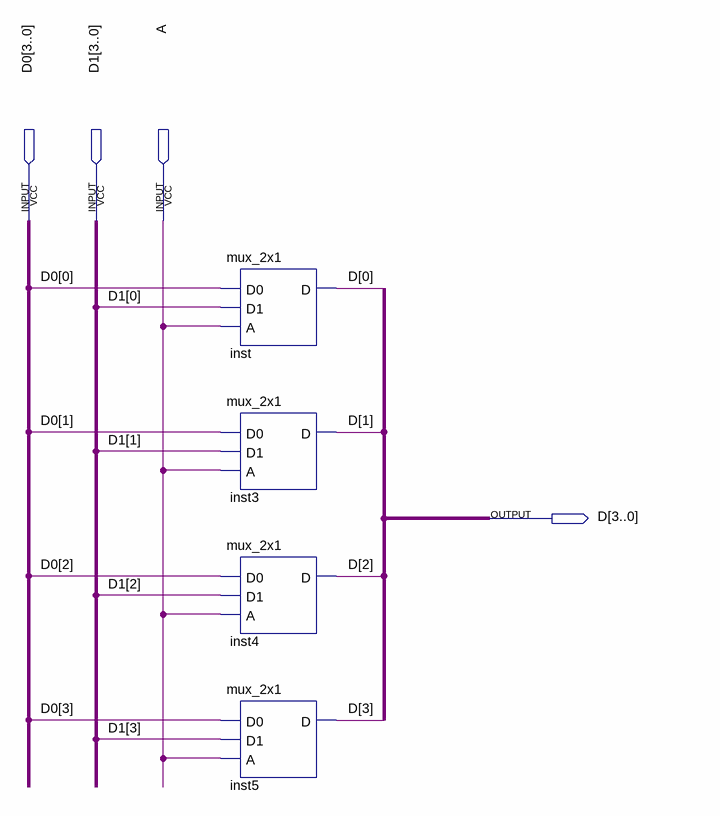
[diagram p0: schematic sheet]
// Quartus schematic mux_4b_2x1.bdf as structural Verilog: 4 symbols, 4 pins
module mux_4b_2x1 (
  input  [3:0] D0,
  input  [3:0] D1,
  input  A,
  output [3:0] D
);

  mux_2x1 inst (.D0(D0[0]), .D1(D1[0]), .A(A), .D(D[0]));
  mux_2x1 inst3 (.D0(D0[1]), .D1(D1[1]), .A(A), .D(D[1]));
  mux_2x1 inst4 (.D0(D0[2]), .D1(D1[2]), .A(A), .D(D[2]));
  mux_2x1 inst5 (.D0(D0[3]), .D1(D1[3]), .A(A), .D(D[3]));
endmodule
